# Altium schematic sheet GAT562 30S Mesh KIT 标注图.SchDoc
size A4
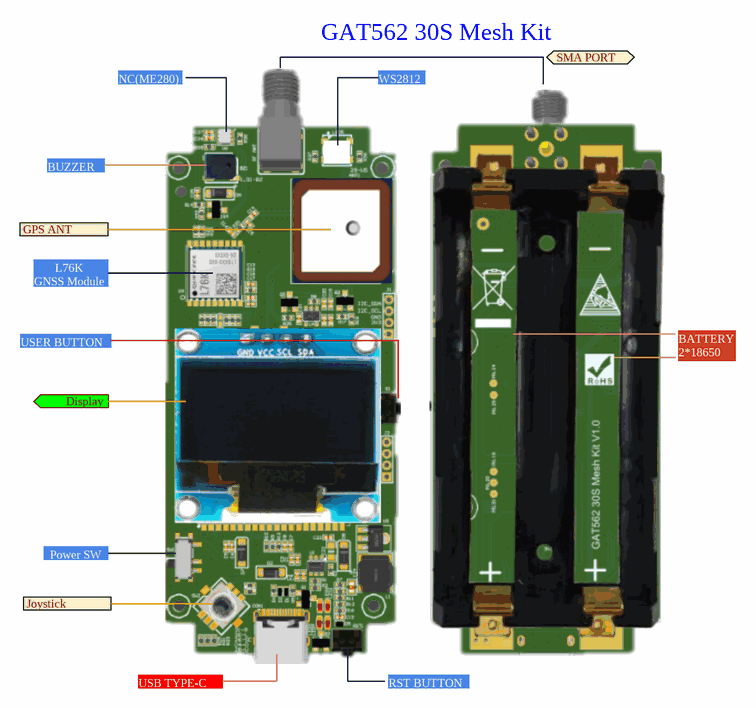
[diagram p0: GAT562 30S Mesh KIT 标注图.SchDoc]

## Ports
Display (out), GPS ANT (in), Joystick (in), SMA PORT (bidir)

## Notes on the sheet
- NC(ME280)
- GAT562 30S Mesh Kit
- WS2812
- BUZZER
- L76K
  GNSS Module
- USER BUTTON
- BATTERY  2*18650
- Power SW
- USB TYPE-C
- RST BUTTON